# Altium schematic sheet filtering-optical-special.SchDoc
size A4
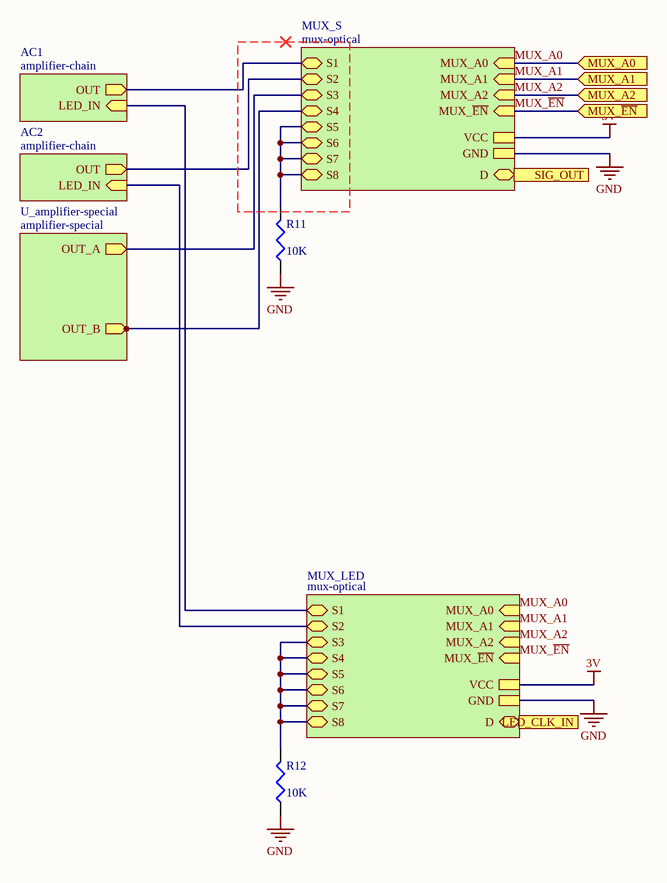
[diagram p0: filtering-optical-special.SchDoc]

## Parts
R11  10K  [0402]
R12  10K  [0402]

## Sub-sheets
AC1 = amplifier-chain: OUT (out), LED_IN (in)
AC2 = amplifier-chain: OUT (out), LED_IN (in)
MUX_LED = mux-optical: MUX_A0 (in), MUX_A1 (in), MUX_A2 (in), MUX_~{EN} (in), VCC, GND, S1 (bidir), S2 (bidir), S3 (bidir), S4 (bidir), S5 (bidir), S6 (bidir), S7 (bidir), S8 (bidir), D (bidir)
MUX_S = mux-optical: MUX_A0 (in), MUX_A1 (in), MUX_A2 (in), MUX_~{EN} (in), VCC, GND, S1 (bidir), S2 (bidir), S3 (bidir), S4 (bidir), S5 (bidir), S6 (bidir), S7 (bidir), S8 (bidir), D (bidir)
U_amplifier-special = amplifier-special: OUT_B (out), OUT_A (out)

## Ports
LED_CLK_IN (in), MUX_A0 (in), MUX_A1 (in), MUX_A2 (in), MUX_~{EN} (in), SIG_OUT (out)

## Nets
3V: sheet MUX_LED/VCC, sheet MUX_S/VCC
GND: R11.1 R12.1 ; sheet MUX_LED/GND, sheet MUX_S/GND
LED_CLK_IN: port LED_CLK_IN, sheet MUX_LED/D
MUX_A0: port MUX_A0, sheet MUX_LED/MUX_A0, sheet MUX_S/MUX_A0
MUX_A1: port MUX_A1, sheet MUX_LED/MUX_A1, sheet MUX_S/MUX_A1
MUX_A2: port MUX_A2, sheet MUX_LED/MUX_A2, sheet MUX_S/MUX_A2
MUX_~{EN}: port MUX_~{EN}, sheet MUX_LED/MUX_~{EN}, sheet MUX_S/MUX_~{EN}
SIG_OUT: port SIG_OUT, sheet MUX_S/D
NetR11_2: R11.2 ; sheet MUX_S/S5, sheet MUX_S/S6, sheet MUX_S/S7, sheet MUX_S/S8
NetR12_2: R12.2 ; sheet MUX_LED/S3, sheet MUX_LED/S4, sheet MUX_LED/S5, sheet MUX_LED/S6, sheet MUX_LED/S7, sheet MUX_LED/S8
(unnamed): sheet AC1/OUT, sheet MUX_S/S1
(unnamed): sheet AC1/LED_IN, sheet MUX_LED/S1
(unnamed): sheet AC2/OUT, sheet MUX_S/S2
(unnamed): sheet AC2/LED_IN, sheet MUX_LED/S2
(unnamed): sheet MUX_S/S3, sheet U_amplifier-special/OUT_A
(unnamed): sheet MUX_S/S4, sheet U_amplifier-special/OUT_B

## Library data of the parts
R11 R12 = Res3: Resistor; Published: 8-Jun-2000; LatestRevisionDate: 29-May-2009; LatestRevisionNote: IPC-7351 Footprint Added.; PackageReference: J1-0603; Publisher: Altium Limited; PackageDescription: Chip Resistor; Value: 10K